# EAGLE design Mouse (EAGLE 7.5.0)
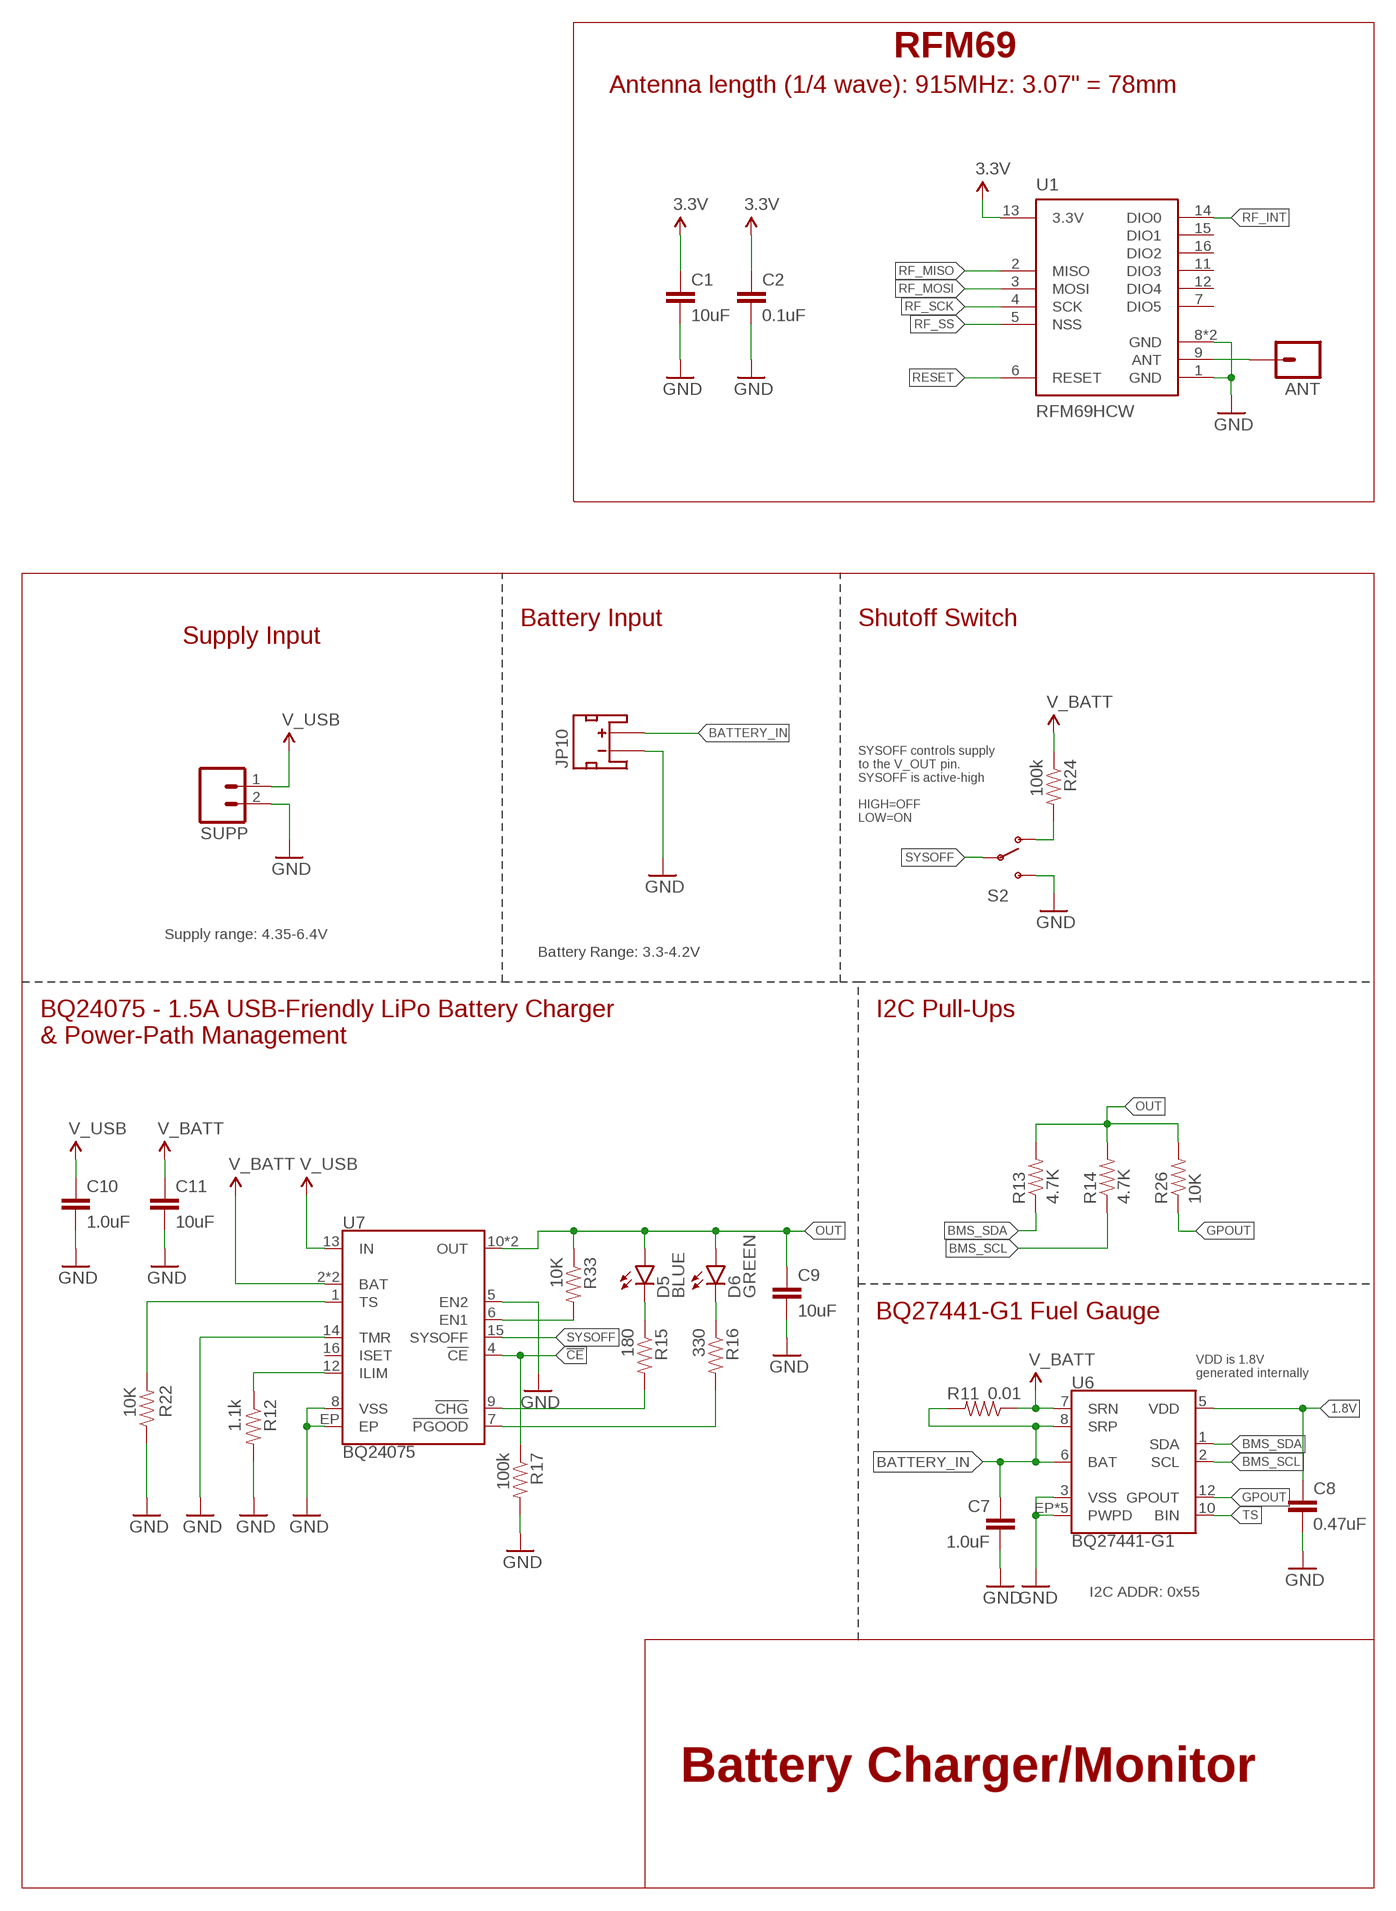
[diagram p0: schematic, sheet 1, part 1 of 2]
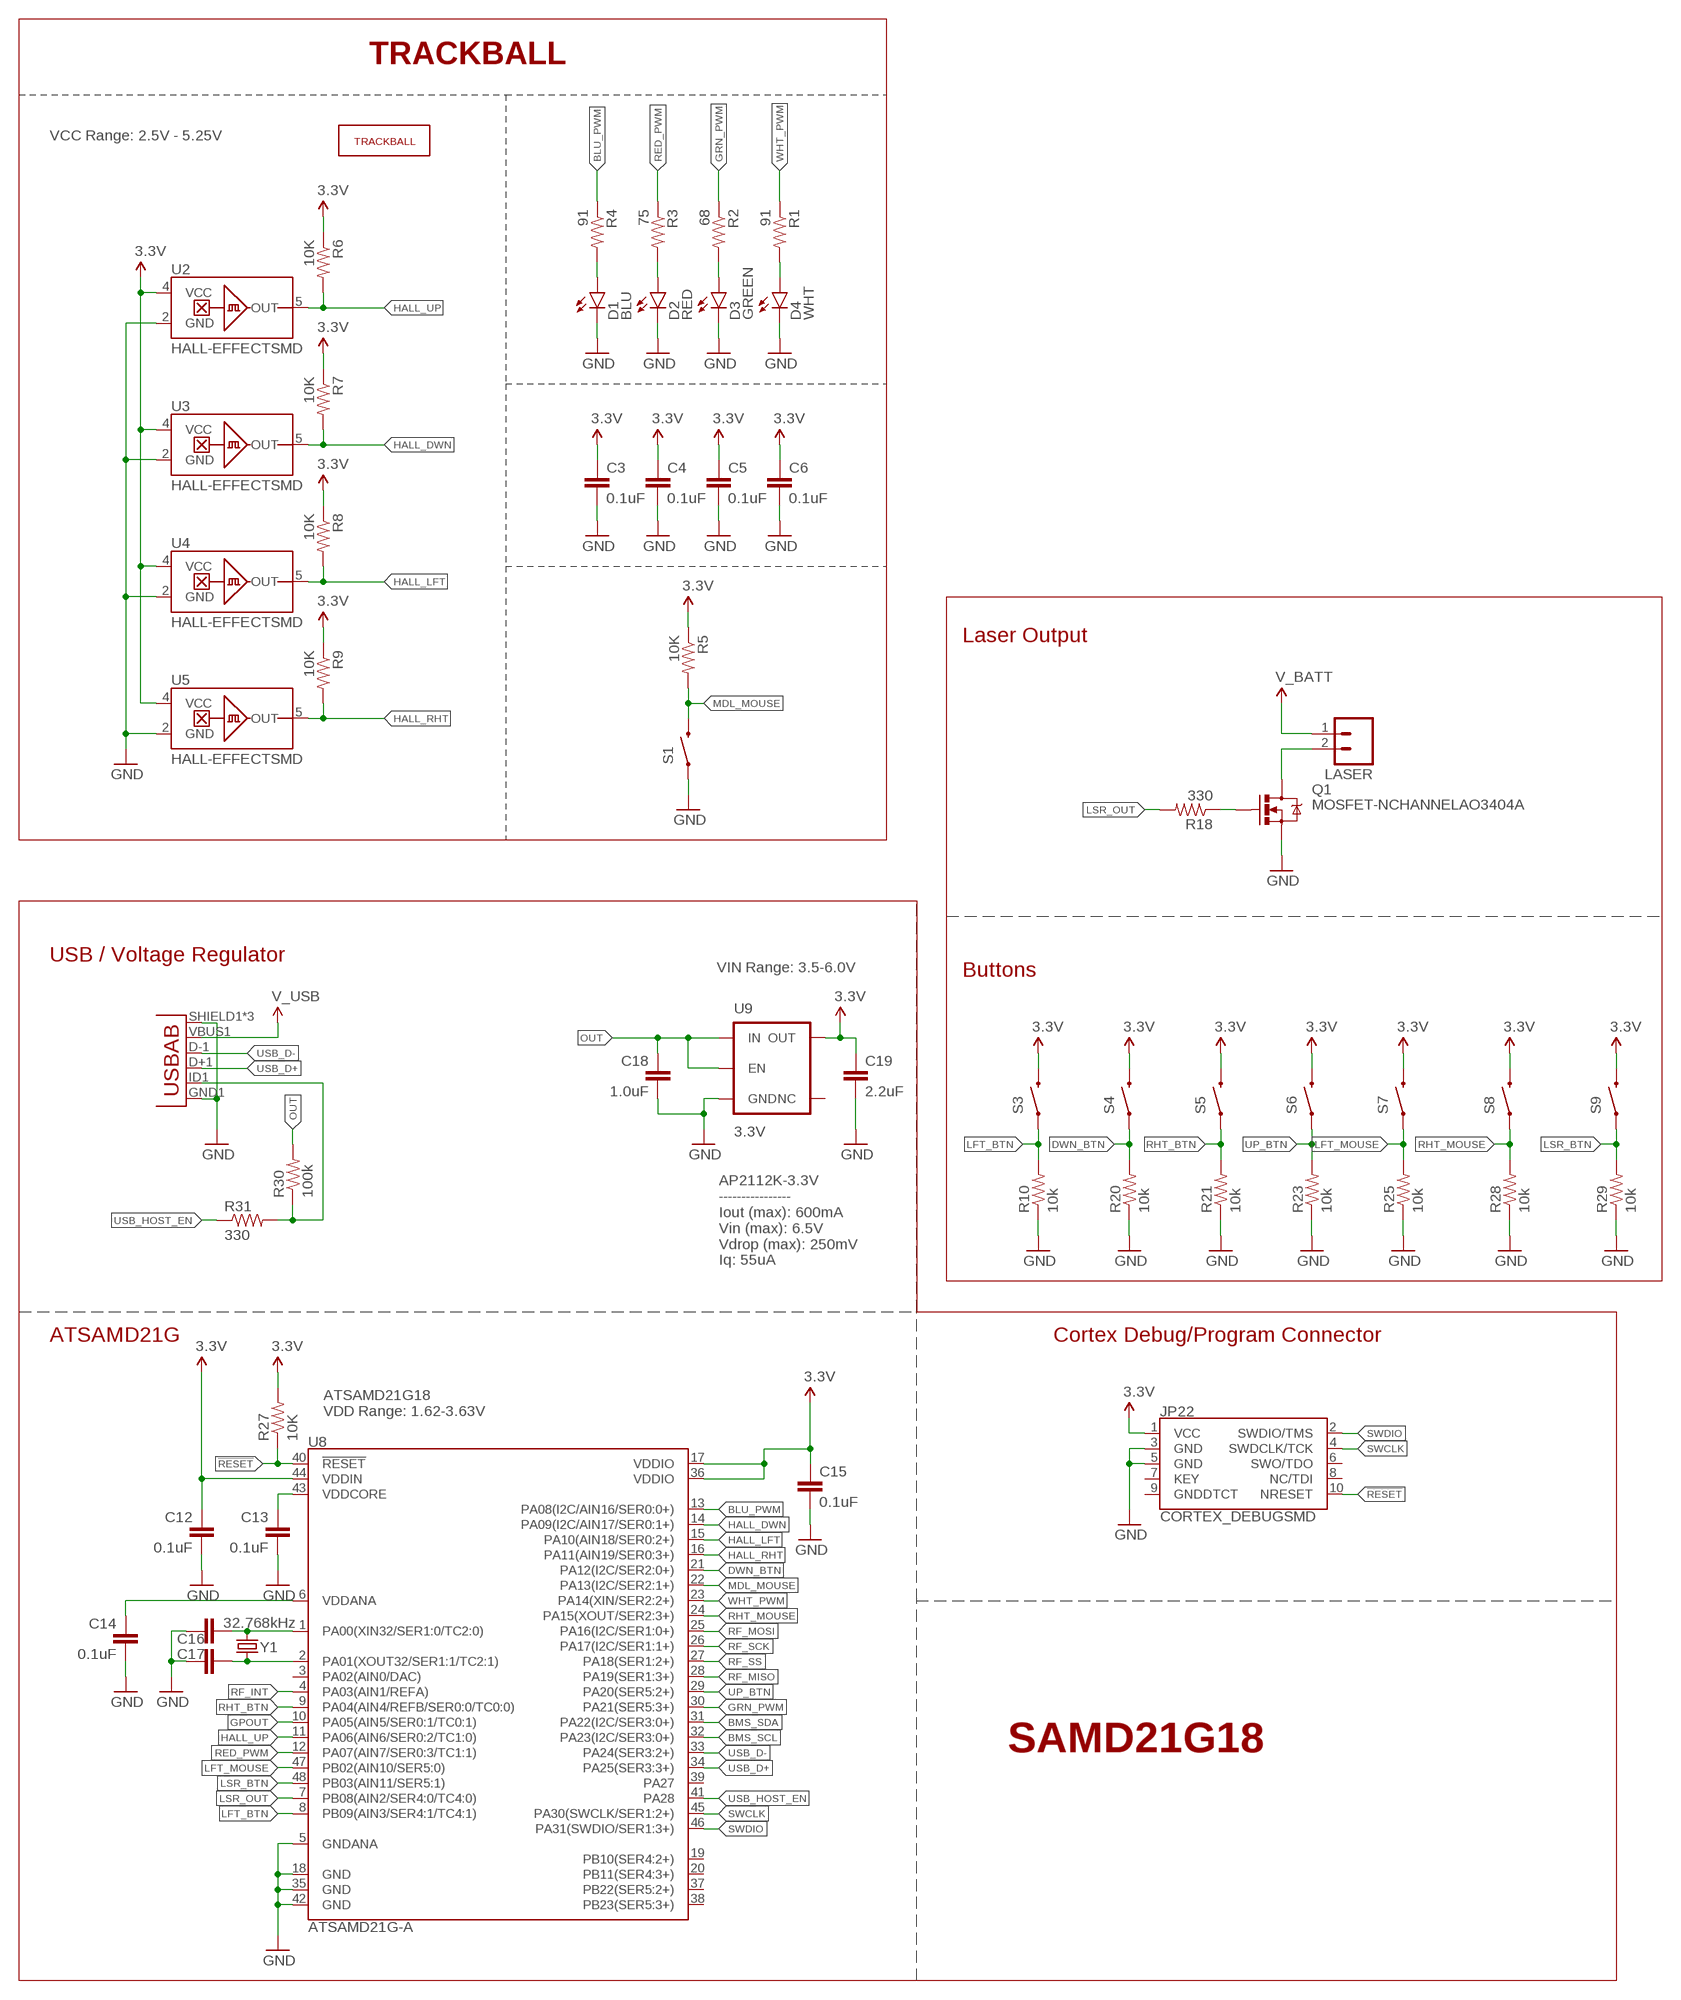
[diagram p1: schematic, sheet 1, part 2 of 2]

## Parts
ANT  M01PTH_NO_SILK_YES_STOP  [1X01_NO_SILK]
C1  10uF  10UF50V20%(1210)  [1210]
C2  0.1uF  0.1UF-25V(+80/-20%)(0603)  [0603-CAP]
C3  0.1uF  0.1UF-25V(+80/-20%)(0603)  [0603-CAP]
C4  0.1uF  0.1UF-25V(+80/-20%)(0603)  [0603-CAP]
C5  0.1uF  0.1UF-25V(+80/-20%)(0603)  [0603-CAP]
C6  0.1uF  0.1UF-25V(+80/-20%)(0603)  [0603-CAP]
C7  1.0uF  1.0UF-16V-10%(0603)  [0603-CAP]
C8  0.47uF  CAP0603-CAP  [0603-CAP]
C9  10uF  10UF10V10%(0805)  [0805-CAP]
C10  1.0uF  1.0UF50V10%(1206)  [1206-CAP]
C11  10uF  10UF10V10%(0805)  [0805-CAP]
C12  0.1uF  CAP0603-CAP  [0603-CAP]
C13  0.1uF  CAP0603-CAP  [0603-CAP]
C14  0.1uF  CAP0603-CAP  [0603-CAP]
C15  0.1uF  CAP0603-CAP  [0603-CAP]
C16  15pF  CAP0603-CAP  [0603-CAP]
C17  15pF  CAP0603-CAP  [0603-CAP]
C18  1.0uF  1.0UF-25V-+80/-20(0805)"  [0805-CAP]
C19  2.2uF  2.2UF-10V-20%(0603)  [0603-CAP]
D1  BLU  LED-BLUE0603  [LED-0603]
D2  RED  LED-RED0603  [LED-0603]
D3  GREEN  LED-GREEN0603  [LED-0603]
D4  WHT  LED-WHITE0603  [LED-0603]
D5  BLUE  LED-BLUE0603  [LED-0603]
D6  GREEN  LED-RED0603  [LED-0603]
JP10  JST_2MM_MALE  [JST-2-SMD]
JP22  CORTEX_DEBUGSMD  [SAMTECH_FTSH-105-01]
JP23  USB-ABCONN-11794  [USB-AB-MICRO-SMD_V03]
LASER  M021X02_NO_SILK  [1X02_NO_SILK]
Q1  MOSFET-NCHANNELAO3404A  [SOT23-3]
R1  91  180OHM1/10W1%(0603)  [0603-RES@2]
R2  68  180OHM1/10W1%(0603)  [0603-RES@2]
R3  75  180OHM1/10W1%(0603)  [0603-RES@2]
R4  91  180OHM1/10W1%(0603)  [0603-RES@2]
R5  10K  10KOHM1/10W1%(0603)0603  [0603-RES@1]
R6  10K  10KOHM1/10W1%(0603)0603  [0603-RES@1]
R7  10K  10KOHM1/10W1%(0603)0603  [0603-RES@1]
R8  10K  10KOHM1/10W1%(0603)0603  [0603-RES@1]
R9  10K  10KOHM1/10W1%(0603)0603  [0603-RES@1]
R10  10k  330OHM1/10W1%(0603)  [0603-RES]
R11  0.01  RESISTOR1206  [1206]
R12  1.1k  RESISTOR0603-RES  [0603-RES]
R13  4.7K  4.7KOHM-1/10W-1%(0603)  [0603-RES@2]
R14  4.7K  4.7KOHM-1/10W-1%(0603)  [0603-RES@2]
R15  180  180OHM1/10W1%(0603)  [0603-RES@2]
R16  330  1KOHM-1/10W-1%(0603)  [0603-RES@2]
R17  100k  100KOHM-1/10W-1%(0603)  [0603-RES]
R18  330  330OHM1/10W1%(0603)  [0603-RES]
R20  10k  330OHM1/10W1%(0603)  [0603-RES]
R21  10k  330OHM1/10W1%(0603)  [0603-RES]
R22  10K  10KOHM-1/10W-1%(0603)0603  [0603-RES]
R23  10k  330OHM1/10W1%(0603)  [0603-RES]
R24  100k  100KOHM-1/10W-1%(0603)  [0603-RES]
R25  10k  330OHM1/10W1%(0603)  [0603-RES]
R26  10K  10KOHM-1/10W-1%(0603)0603  [0603-RES]
R27  10K  10KOHM-1/10W-1%(0603)0603  [0603-RES]
R28  10k  330OHM1/10W1%(0603)  [0603-RES]
R29  10k  330OHM1/10W1%(0603)  [0603-RES]
R30  100k  100KOHM-1/10W-1%(0603)  [0603-RES]
R31  330  330OHM1/10W1%(0603)  [0603-RES]
R33  10K  10KOHM-1/10W-1%(0603)0603  [0603-RES]
S1  SWITCH-MOMENTARY-2SMD-2  [TACTILE_SWITCH_SMD-2]
S2  SWITCH-SPDT-SMD-A  [SWITCH-SPST-SMD-A]
S3  SWITCH-MOMENTARY-2SMD-4  [TACTILE_SWITCH_TALL]
S4  SWITCH-MOMENTARY-2SMD-4  [TACTILE_SWITCH_TALL]
S5  SWITCH-MOMENTARY-2SMD-4  [TACTILE_SWITCH_TALL]
S6  SWITCH-MOMENTARY-2SMD-4  [TACTILE_SWITCH_TALL]
S7  SWITCH-MOMENTARY-2SMD-4  [TACTILE_SWITCH_TALL]
S8  SWITCH-MOMENTARY-2SMD-4  [TACTILE_SWITCH_TALL]
S9  SWITCH-MOMENTARY-2SMD-4  [TACTILE_SWITCH_TALL]
SUPP  M021X02_NO_SILK  [1X02_NO_SILK]
U1  RFM69HCW  [RFM69HCW-XXXS2]
U2  HALL-EFFECTSMD  [SC70]
U3  HALL-EFFECTSMD  [SC70]
U4  HALL-EFFECTSMD  [SC70]
U5  HALL-EFFECTSMD  [SC70]
U6  BQ27441-G1  [PDSO-N12]
U7  BQ24075  [PVQFN-N16]
U8  ATSAMD21G-A  [TQFP-48]
U9  3.3V  V_REG_AP2112K-3.3V  [SOT23-5]
U$1  TRACKBALLMECH  [TRACKBALL]
Y1  32.768kHz  CRYSTAL3.2X1.5MM  [CRYSTAL-SMD-3.2X1.5MM]

## Nets
1.8V: C8.1 U6.5(VDD)
3.3V: C1.1 C2.1 C3.1 C4.1 C5.1 C6.1 C12.1 C15.1 C19.1 JP22.1(VCC) R5.1 R6.1 R7.1 R8.1 R9.1 R27.2 S3.B2 S4.B2 S5.B2 S6.B2 S7.B2 S8.B2 S9.B2 U1.13(3.3V) U2.4(VCC) U3.4(VCC) U4.4(VCC) U5.4(VCC) U8.17(VDDIO) U8.36(VDDIO) U8.44(VDDIN) U9.5(OUT)
!CE!: R17.1 U7.4(!CE!)
!CHG!: R15.2 U7.9(!CHG!)
!PGOOD!: R16.2 U7.7(!PGOOD!)
!RESET: JP22.10(NRESET) R27.1 U8.40(!RESET!)
ANT: ANT.1 U1.9(ANT)
BATTERY_IN: C7.1 JP10.2(+) R11.2 U6.6(BAT) U6.8(SRP)
BLU_PWM: R4.1 U8.13(PA08(I2C/AIN16/SER0:0+))
BMS_SCL: R14.1 U6.2(SCL) U8.32(PA23(I2C/SER3:0+))
BMS_SDA: R13.1 U6.1(SDA) U8.31(PA22(I2C/SER3:0+))
DWN_BTN: R20.2 S4.A2 U8.21(PA12(I2C/SER2:0+))
EN1: R33.2 U7.6(EN1)
GND: C1.2 C2.2 C3.2 C4.2 C5.2 C6.2 C7.2 C8.2 C9.2 C10.2 C11.2 C12.2 C13.2 C14.2 C15.2 C16.1 C17.2 C18.2 C19.2 D1.C D2.C D3.C D4.C JP10.1(-) JP22.3(GND) JP22.5(GND) JP23.GND1(GND) JP23.SHIELD1(SHIELD) JP23.SHIELD2(SHIELD) JP23.SHIELD3(SHIELD) Q1.2(S) R10.1 R12.2 R17.2 R20.1 R21.1 R22.1 R23.1 R25.1 R28.1 R29.1 S1.2 S2.3(S) SUPP.2 U1.1(GND) U1.8(GND) U1.10(GND) U2.2(GND) U3.2(GND) U4.2(GND) U5.2(GND) U6.3(VSS) U6.EP1(PWPD) U6.EP2(PWPD) U6.EP3(PWPD) U6.EP4(PWPD) U6.EP(PWPD) U7.5(EN2) U7.8(VSS) U7.14(TMR) U7.EP U8.5(GNDANA) U8.18(GND) U8.35(GND) U8.42(GND) U9.2(GND)
GPOUT: R26.1 U6.12(GPOUT) U8.10(PA05(AIN5/SER0:1/TC0:1))
GRN_PWM: R2.1 U8.30(PA21(SER5:3+))
HALL_DWN: R7.2 U3.5(OUT) U8.14(PA09(I2C/AIN17/SER0:1+))
HALL_LFT: R8.2 U4.5(OUT) U8.15(PA10(AIN18/SER0:2+))
HALL_RHT: R9.2 U5.5(OUT) U8.16(PA11(AIN19/SER0:3+))
HALL_UP: R6.2 U2.5(OUT) U8.11(PA06(AIN6/SER0:2/TC1:0))
ILIM: R12.1 U7.12(ILIM)
LFT_BTN: R10.2 S3.A2 U8.8(PB09(AIN3/SER4:1/TC4:1))
LFT_MOUSE: R25.2 S7.A2 U8.47(PB02(AIN10/SER5:0))
LSR_BTN: R29.2 S9.A2 U8.48(PB03(AIN11/SER5:1))
LSR_OUT: R18.2 U8.7(PB08(AIN2/SER4:0/TC4:0))
MDL_MOUSE: R5.2 S1.1 U8.22(PA13(I2C/SER2:1+))
N$1: D3.A R2.2
N$2: D2.A R3.2
N$3: D1.A R4.2
N$4: D4.A R1.2
N$5: R24.2 S2.1(O)
N$6: Q1.1(G) R18.1
N$8: LASER.2 Q1.3(D)
N$10: C16.2 U8.1(PA00(XIN32/SER1:0/TC2:0)) Y1.P$2
N$11: D5.C R15.1
N$12: D6.C R16.1
N$13: C17.1 U8.2(PA01(XOUT32/SER1:1/TC2:1)) Y1.P$1
N$19: JP23.ID1(USBID) R30.1 R31.2
OUT: C9.1 C18.1 D5.A D6.A R13.2 R14.2 R26.2 R30.2 R33.1 U7.10(OUT) U7.11(OUT) U9.1(IN) U9.3(EN)
RED_PWM: R3.1 U8.12(PA07(AIN7/SER0:3/TC1:1))
RESET: U1.6(RESET)
RF_INT: U1.14(DIO0) U8.4(PA03(AIN1/REFA))
RF_MISO: U1.2(MISO) U8.28(PA19(SER1:3+))
RF_MOSI: U1.3(MOSI) U8.25(PA16(I2C/SER1:0+))
RF_SCK: U1.4(SCK) U8.26(PA17(I2C/SER1:1+))
RF_SS: U1.5(NSS) U8.27(PA18(SER1:2+))
RHT_BTN: R21.2 S5.A2 U8.9(PA04(AIN4/REFB/SER0:0/TC0:0))
RHT_MOUSE: R28.2 S8.A2 U8.24(PA15(XOUT/SER2:3+))
SWCLK: JP22.4(SWDCLK/TCK) U8.45(PA30(SWCLK/SER1:2+))
SWDIO: JP22.2(SWDIO/TMS) U8.46(PA31(SWDIO/SER1:3+))
SYSOFF: S2.2(P) U7.15(SYSOFF)
TS: R22.2 U6.10(BIN) U7.1(TS)
UP_BTN: R23.2 S6.A2 U8.29(PA20(SER5:2+))
USB_D+: JP23.D+1(D+) U8.34(PA25(SER3:3+))
USB_D-: JP23.D-1(D-) U8.33(PA24(SER3:2+))
USB_HOST_EN: R31.1 U8.41(PA28)
V_BATT: C11.1 LASER.1 R11.1 R24.1 U6.7(SRN) U7.2(BAT) U7.3(BAT)
V_USB: C10.1 JP23.VBUS1(VBUS) SUPP.1 U7.13(IN)
VDDANA: C14.1 U8.6(VDDANA)
VDDCORE: C13.1 U8.43(VDDCORE)
WHT_PWM: R1.1 U8.23(PA14(XIN/SER2:2+))
Unconnected: JP10.NC1(PAD1) JP10.NC2(PAD2) JP22.6(SWO/TDO) JP22.7(KEY) JP22.8(NC/TDI) JP22.9(GNDDTCT) U1.7(DIO5) U1.11(DIO3) U1.12(DIO4) U1.15(DIO1) U1.16(DIO2) U7.16(ISET) U8.3(PA02(AIN0/DAC)) U8.19(PB10(SER4:2+)) U8.20(PB11(SER4:3+)) U8.37(PB22(SER5:2+)) U8.38(PB23(SER5:3+)) U8.39(PA27) U9.4(NC)

## Notes on the sheet
- TRACKBALL
- VCC Range: 2.5V - 5.25V
- RFM69
- Antenna length (1/4 wave): 915MHz: 3.07" = 78mm
- Laser Output
- Battery Input | Shutoff Switch
- Supply Input
- USB / Voltage Regulator
- VIN Range: 3.5-6.0V | Buttons
- SYSOFF controls supply 
  to the V_OUT pin.
  SYSOFF is active-high
  
  HIGH=OFF
  LOW=ON
- Supply range: 4.35-6.4V
- Battery Range: 3.3-4.2V
- AP2112K-3.3V
  ----------------
  Iout (max): 600mA 
  Vin (max): 6.5V
  Vdrop (max): 250mV
  Iq: 55uA
- BQ24075 - 1.5A USB-Friendly LiPo Battery Charger 
  & Power-Path Management
- I2C Pull-Ups
- ATSAMD21G | Cortex Debug/Program Connector
- ATSAMD21G18
  VDD Range: 1.62-3.63V
- BQ27441-G1 Fuel Gauge
- VDD is 1.8V
  generated internally
- I2C ADDR: 0x55
- SAMD21G18
- Battery Charger/Monitor

## Library data of the parts
ANT = SparkFun-Connectors:M01: Header 1 Standard 1-pin 0.1" header. Use with straight break away headers (SKU : PRT-00116), right angle break away headers (PRT-00553), swiss pins (PRT-00743), machine pins (PRT-00117), and female headers (PRT-00115). SMTSO-256-ET is a "flush mount" nut for a 4-40 screw. The older package used to be too tight, and did not allow it to sit properly thru the drill hit. The latest (0.165DIA) fits nice and snug.
C1 = SparkFun-Capacitors:10UF50V20%(1210): CAP-09824; PROD_ID: CAP-09824
C2-C6 = SparkFun-Capacitors:0.1UF-25V(+80/-20%)(0603): CAP-00810 Ceramic Standard decoupling cap; PROD_ID: CAP-00810
C7 = SparkFun-Capacitors:1.0UF-16V-10%(0603): CAP-00868; PROD_ID: CAP-00868
C8 = SparkFun-Capacitors:CAP: Capacitor Standard 0603 ceramic capacitor, and 0.1" leaded capacitor.; PROD_ID: CAP-13216
C9 C11 = SparkFun-Capacitors:10UF10V10%(0805): CAP-11330; PROD_ID: CAP-11330
C10 = SparkFun-Capacitors:1.0UF50V10%(1206): CAP-09822; PROD_ID: CAP-09822
C12-C17 = SparkFun-Capacitors:CAP: Capacitor Standard 0603 ceramic capacitor, and 0.1" leaded capacitor.
C18 = SparkFun-Capacitors:1.0UF-25V-+80/-20(0805): CAP-11625; PROD_ID: CAP-11625
C19 = SparkFun-Capacitors:2.2UF-10V-20%(0603): CAP-07888; PROD_ID: CAP-07888
D1 = SparkFun-LED:LED-BLUE: Blue LEDs for production use Various blue LEDs stocked by SparkFun production 0603 - DIO-08575 Rebel - DIO-09553 1206 - DIO-09911; PROD_ID: DIO-08575; VALUE: BLUE
D2 = SparkFun-LED:LED-RED: Assorted Red LEDs LilyPad 1206- DIO-09912 1206- DIO-00809 0603- DIO-00819 "SMART" means more efficient and expensive; PROD_ID: DIO-00819
D3 = SparkFun-LED:LED-GREEN: Various green LEDs Green LEDs used in SFE Production 0603- DIO-00821 LARGE- DIO-00862 LILYPAD- DIO-09910; PROD_ID: DIO-00821
D4 = SparkFun-LED:LED-WHITE: White SMD LEDs LilyPad 1206- DIO-09955; PROD_ID: DIO-09004
D5 = SparkFun-LED:LED-BLUE: Blue LEDs for production use Various blue LEDs stocked by SparkFun production 0603 - DIO-08575 Rebel - DIO-09553 1206 - DIO-09911; PROD_ID: DIO-08575
D6 = SparkFun-LED:LED-RED: Assorted Red LEDs LilyPad 1206- DIO-09912 1206- DIO-00809 0603- DIO-00819 "SMART" means more efficient and expensive; PROD_ID: DIO-00819; VALUE: RED
JP10 = SparkFun-Connectors:JST_2MM_MALE: Mates to single-cell LiPo batteries. CONN-11443 Now with smashable polarity marks!; BTM_NEG: -; BTM_POS: +; PROD_ID: CONN-11443; TOP_NEG: -; TOP_POS: +
JP22 = SparkFun-Connectors:CORTEX_DEBUG: Cortex Debug Connector Datasheet <http://infocenter.arm.com/help/topic/com.arm.doc.faqs/attached/13634/cortex_debug_connectors.pdf>
JP23 = SparkFun-Connectors:USB-AB: This is a USB AB connector that is compatible with USB OTG. i.e. this connector can serve as a host or device; PROD_ID: CONN-11794
LASER = SparkFun-Connectors:M02: Standard 2-pin 0.1" header. Use with - straight break away headers ( PRT-00116) - right angle break away headers (PRT-00553) - swiss pins (PRT-00743) - machine pins (PRT-00117) - female headers (PRT-00115) Molex polarized connector foot print use with: PRT-08233 with associated crimp pins and housings. 2.54_SCREWTERM for use with PRT-10571. 3.5mm Screw Terminal footprints for PRT-08084 5mm Screw Terminal footprints for use with PRT-08432
Q1 = SparkFun-DiscreteSemi:MOSFET-NCHANNEL: Common NMOSFET Parts MFG P/N Store ID Prod ID FDD8780 TRANS-09984 SI7820DN TRANS-11055 FDS6630A IC-08089 2N7002PW TRANS-11151 FQP30N06L COM-10213 TRANS-10060 BSS123LT1G TRANS-08345 BSS138 TRANS-00830 BS170 2N7000; PROD_ID: TRAN-12988
R1-R4 = SparkFun-Resistors:180OHM1/10W1%(0603): RES-08788; PROD_ID: RES-08788; VALUE: 180
R5-R9 = SparkFun-Resistors:10KOHM1/10W1%(0603): RES-00824; PROD_ID: RES-00824
R10 R20 R21 R23 R25 R28 R29 = SparkFun-Resistors:330OHM1/10W1%(0603): RES-00818; PROD_ID: RES-00818; VALUE: 330
R11 = SparkFun-Resistors:RESISTOR: Resistor Basic schematic elements and footprints for 0603, 1206, and PTH resistors.; PROD_ID: RES-13218
R12 = SparkFun-Passives:RESISTOR: Resistor Basic schematic elements and footprints for 0603, 1206, and PTH resistors.; PROD_ID: RES-10447
R13 R14 = SparkFun-Resistors:4.7KOHM-1/10W-1%(0603): RES-07857; PROD_ID: RES-07857
R15 = SparkFun-Resistors:180OHM1/10W1%(0603): RES-08788; PROD_ID: RES-08788
R16 = SparkFun-Resistors:1KOHM-1/10W-1%(0603): RES-07856; PROD_ID: RES-07856; VALUE: 1K
R17 R24 R30 = SparkFun-Resistors:100KOHM-1/10W-1%(0603): RES-07828; PROD_ID: RES-07828
R18 R31 = SparkFun-Resistors:330OHM1/10W1%(0603): RES-00818; PROD_ID: RES-00818
R22 R26 R27 R33 = SparkFun-Resistors:10KOHM-1/10W-1%(0603): RES-00824; PROD_ID: RES-00824
S1 = SparkFun-Electromechanical:SWITCH-MOMENTARY-2: Various NO switches- pushbuttons, reed, etc; PROD_ID: SWCH-09213
S2 = SparkFun-Electromechanical:SWITCH-SPDT: SPDT Switch Simple slide switch, Spark Fun Electronics SKU : COM-00102 DPDT SMT slide switch, AYZ0202, SWCH-08179; PROD_ID: SWCH-10651
S3-S9 = SparkFun-Electromechanical:SWITCH-MOMENTARY-2: Various NO switches- pushbuttons, reed, etc; PROD_ID: SWCH-11966
SUPP = mike-temp:M02: Header 2 Standard 2-pin 0.1" header. Use with straight break away headers (SKU : PRT-00116), right angle break away headers (PRT-00553), swiss pins (PRT-00743), machine pins (PRT-00117), and female headers (PRT-00115). Molex polarized connector foot print use with SKU : PRT-08233 with associated crimp pins and housings.
U1 = mike-temp:RFM69H
U2-U5 = SparkFun-Sensors:HALL-EFFECT: Hall effect sensor in SC70 package; PROD_ID: IC-09214
U6 = battery-management-temp:BQ27441-G1; PROD_ID: IC-13220
U7 = battery-management-temp:BQ24075; PROD_ID: IC-13219
U8 = samd21-temp:ATSAMD21G: Atmel SAMD21G SMART ARM-Based Microcontroller The Atmel ® | SMART ™ SAM D21 is a series of low-power microcontrollers using the 32-bit ARM ® Cortex ® -M0+ processor, and ranging from 32- to 64-pins with up to 256KB Flash and 32KB of SRAM. The SAM D21 devices operate at a maximum frequency of 48MHz and reach 2.46 CoreMark/MHz. They are designed for simple and intuitive migration with identical peripheral modules, hex compatible code, identical linear address map and pin compatible migration paths between all devices in the product series. All devices include intelligent and flexible peripherals, Atmel Event System for inter-peripheral signaling, and support for capacitive touch button, slider and wheel user interfaces.; PROD_ID: IC-13064
U9 = SparkFun-PowerIC:V_REG_AP2112: AP2112 - 600mA CMOS LDO Regulator w/ Enable The AP2112 is CMOS process low dropout linear regulator with enable function, the regulator delivers a guaranteed 600mA (min.) continuous load current. Features Output Voltage Accuracy: ±1.5% Output Current: 600mA (Min.) Foldback Short Current Protection: 50mA Enable Function to Turn ON/OFF VOUT Low Dropout Voltage (3.3V): 250mV (Typ.) @IOUT=600mA Excellent Load Regulation: 0.2%/A (Typ.) Excellent Line Regulation: 0.02%/V (Typ.) Low Quiescent Current: 55μA (Typ.) Low Standby Current: 0.01μA (Typ.) Low Output Noise: 50μVRMS PSRR: 100Hz -65dB, 1kHz -65dB OTSD Protection Stable with 1.0μF Flexible Cap: Ceramic, Tantalum and Aluminum Electrolytic Operation Temperature Range: -40°C to 85°C ESD: MM 400V, HBM 4000V; PROD_ID: VREG-12457
U$1 = SparkFun-Electromechanical:TRACKBALL: Mechanical footprint for trackball; PROD_ID: COMP-09237
Y1 = samd21-temp:CRYSTAL: Various standard crystals. Proven footprints.; PROD_ID: XTAL-13062

## Board
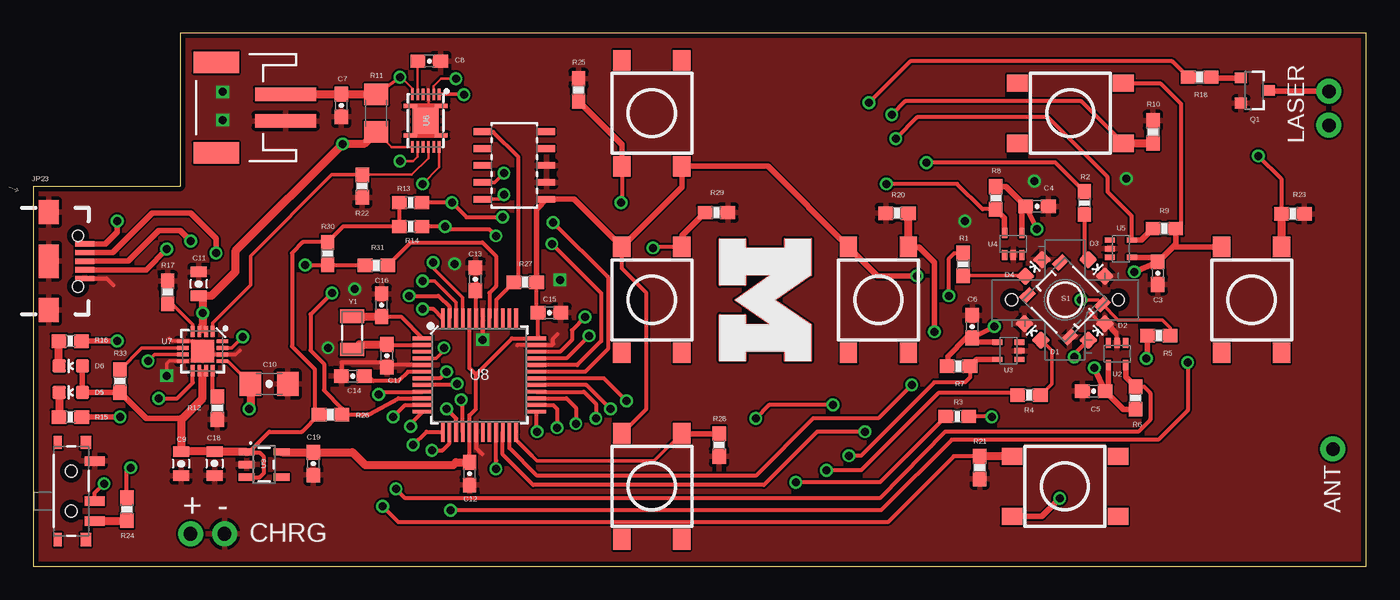
[diagram p2: board, top side]
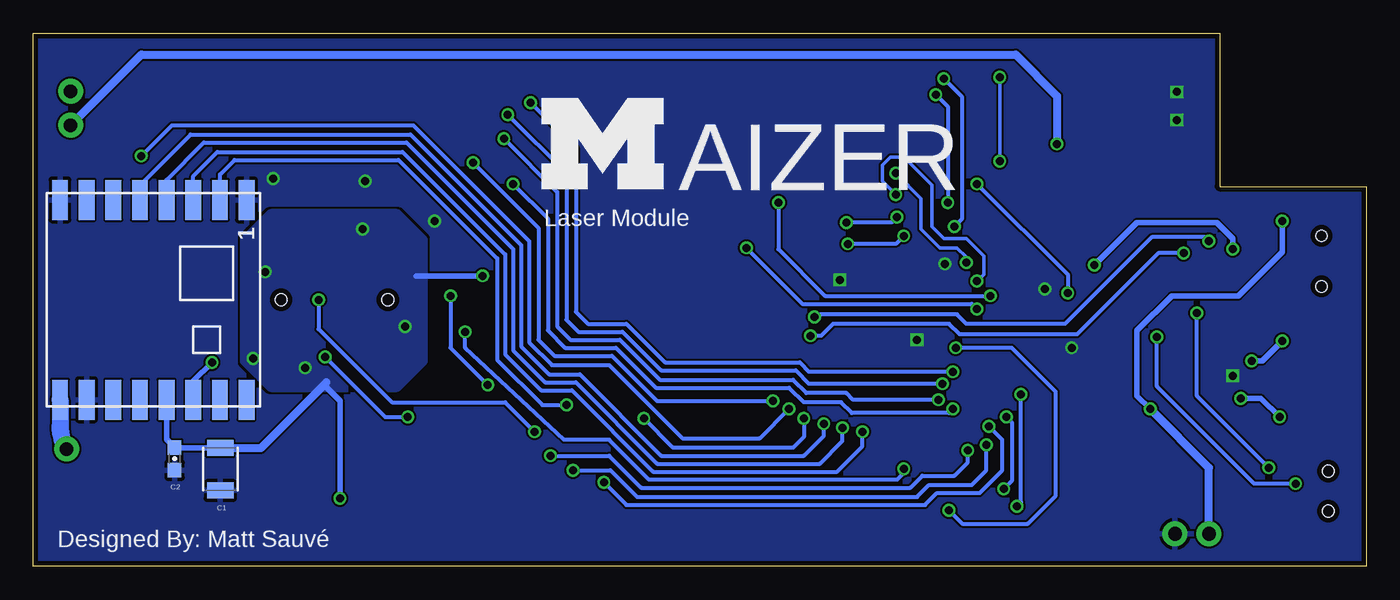
[diagram p3: board, bottom side, seen from below]

Size 100 x 40 mm. Coordinates in mm from the lower left corner, seen from the top.
Outline: 0,0 100,0 100,40 11,40 11,28.5 0,28.5 0,0
Copper layers (1*16): Top 0.0356mm / dielectric 1.5011mm / Bottom 0.0356mm
Design rules "oshpark-2layer": minimum track width 6mil, minimum drill 13mil, track to track 6mil, track to pad 6mil, pad to pad 6mil, via to via 6mil, smd to smd 6mil, copper to edge 15mil, drill to drill 6mil, minimum pad ring 7mil, minimum via ring 7mil, stop-mask expansion 2.5mil, vias tented up to drill 0mil, thermal gap 10mil

### Footprints (pad centres in the part's own frame; a part is rotated, then mirrored left to right if it is on the bottom)
1X01_NO_SILK = drill 1.016 pad 1.88: 1 0,0
1210 = smd 1.2 x 2: 1 -1.6,0; 2 1.6,0
0603-CAP = smd 1.1 x 1: 1 -0.85,0; 2 0.85,0
0805-CAP = smd 0.8 x 1.2: 1 -0.9,0; 2 0.9,0
1206-CAP = smd 1.6 x 1.8: 1 -1.4,0; 2 1.4,0
LED-0603 = smd 1 x 1: A 0,-0.877; C 0,0.877
JST-2-SMD = smd 1 x 4.6: 1 -1,-3.7; 2 1,-3.7 | smd 1.6 x 3.4: NC1 -3.4,1.5; NC2 3.4,1.5
SAMTECH_FTSH-105-01 = smd 0.508 x 1.27: 1 -2.54,-2.413; 2 -2.54,2.413; 3 -1.27,-2.413; 4 -1.27,2.413; 5 0,-2.413; 6 0,2.413; 7 1.27,-2.413; 8 1.27,2.413; 9 2.54,-2.413; 10 2.54,2.413
USB-AB-MICRO-SMD_V03 = smd 1.4 x 0.4: D+1 2.7,0; D-1 2.7,0.65; GND1 2.7,-1.3; ID1 2.7,-0.65; VBUS1 2.7,1.3 | smd 1.5 x 1.8: SHIELD1 0,3.68; SHIELD3 0,-3.68 | smd 1.5 x 2.5: SHIELD2 0,0 | hole 0.85: 2.2,1.9; 2.2,-1.9
1X02_NO_SILK = drill 1.016 pad 1.88: 1 0,0; 2 2.54,0
SOT23-3 = smd 0.8 x 0.9: 1 -0.95,-1; 2 0.95,-1; 3 0,1.1
0603-RES@2 = smd 1.1 x 1: 1 -0.85,0; 2 0.85,0
0603-RES@1 = smd 1.1 x 1: 1 -0.85,0; 2 0.85,0
0603-RES = smd 1.1 x 1: 1 -0.85,0; 2 0.85,0
1206 = smd 1.6 x 1.8: 1 -1.4,0; 2 1.4,0
TACTILE_SWITCH_SMD-2 = smd 0.7 x 1.1: 1 2.225,1.75; 2 2.225,-1.75; 3 -2.225,-1.75; 4 -2.225,1.75
SWITCH-SPST-SMD-A = smd 0.7 x 1.5: 1 -2.25,-1.75; 2 -0.75,-1.75; 3 2.25,-1.75 | smd 1 x 0.6: GND1 -3.65,1; GND3 3.65,1 | smd 1 x 0.8: GND2 -3.65,-1.1; GND4 3.65,-1.1 | hole 0.9: -1.5,0; 1.5,0
TACTILE_SWITCH_TALL = smd 1.55 x 1.3: A1 -3.975,-2.25; A2 3.975,-2.25; B1 -3.975,2.25; B2 3.975,2.25
RFM69HCW-XXXS2 = smd 3 x 1.2: 1 -7.5,7; 2 -7.5,5; 3 -7.5,3; 4 -7.5,1; 5 -7.5,-1; 6 -7.5,-3; 7 -7.5,-5; 8 -7.5,-7; 9 7.5,-7; 10 7.5,-5; 11 7.5,-3; 12 7.5,-1; 13 7.5,1; 14 7.5,3; 15 7.5,5; 16 7.5,7
SC70 = smd 0.4 x 0.75: 1 -0.65,-0.825; 2 0,-0.825; 3 0.65,-0.825; 4 0.65,0.825; 5 -0.65,0.825
PDSO-N12 = smd 0.2 x 0.85: 1 -1,-1.975; 2 -0.6,-1.975; 3 -0.2,-1.975; 4 0.2,-1.975; 5 0.6,-1.975; 6 1,-1.975; 7 1,1.975; 8 0.6,1.975; 9 0.2,1.975; 10 -0.2,1.975; 11 -0.6,1.975; 12 -1,1.975 | smd 1.95 x 1.95: EP 0,0 | smd 1 x 0.25: EP1 -1.15,1.1; EP2 -1.15,-1.1; EP3 1.15,-1.1; EP4 1.15,1.1
PVQFN-N16 = smd 0.28 x 0.85: 1 -0.75,-1.475; 2 -0.25,-1.475; 3 0.25,-1.475; 4 0.75,-1.475; 9 0.75,1.475; 10 0.25,1.475; 11 -0.25,1.475; 12 -0.75,1.475 | smd 0.85 x 0.28: 5 1.475,-0.75; 6 1.475,-0.25; 7 1.475,0.25; 8 1.475,0.75; 13 -1.475,0.75; 14 -1.475,0.25; 15 -1.475,-0.25; 16 -1.475,-0.75 | smd 1.7 x 1.7: EP 0,0
TQFP-48 = smd 1.5 x 0.28: 1 -4.25,2.75; 2 -4.25,2.25; 3 -4.25,1.75; 4 -4.25,1.25; 5 -4.25,0.75; 6 -4.25,0.25; 7 -4.25,-0.25; 8 -4.25,-0.75; 9 -4.25,-1.25; 10 -4.25,-1.75; 11 -4.25,-2.25; 12 -4.25,-2.75; 25 4.25,-2.75; 26 4.25,-2.25; 27 4.25,-1.75; 28 4.25,-1.25; 29 4.25,-0.75; 30 4.25,-0.25; 31 4.25,0.25; 32 4.25,0.75; 33 4.25,1.25; 34 4.25,1.75; 35 4.25,2.25; 36 4.25,2.75 | smd 0.28 x 1.5: 13 -2.75,-4.25; 14 -2.25,-4.25; 15 -1.75,-4.25; 16 -1.25,-4.25; 17 -0.75,-4.25; 18 -0.25,-4.25; 19 0.25,-4.25; 20 0.75,-4.25; 21 1.25,-4.25; 22 1.75,-4.25; 23 2.25,-4.25; 24 2.75,-4.25; 37 2.75,4.25; 38 2.25,4.25; 39 1.75,4.25; 40 1.25,4.25; 41 0.75,4.25; 42 0.25,4.25; 43 -0.25,4.25; 44 -0.75,4.25; 45 -1.25,4.25; 46 -1.75,4.25; 47 -2.25,4.25; 48 -2.75,4.25
SOT23-5 = smd 0.55 x 1.2: 1 -0.95,-1.3; 2 0,-1.3; 3 0.95,-1.3; 4 0.95,1.3; 5 -0.95,1.3
TRACKBALL = hole 0.9: -4,0; 4,0
CRYSTAL-SMD-3.2X1.5MM = smd 1 x 1.8: P$1 -1.25,0; P$2 1.25,0

### Placement (x,y rotation side)
ANT  97.5,8.8 180 top
C1  85.97,7.28 270 bottom
C2  89.4,8.06 270 bottom
C3  84.36,21.99 270 top
C4  75.3,27.01 0 top
C5  79.56,13.14 180 top
C6  70.44,17.98 90 top
C7  23.11,34.58 270 top
C8  29.71,37.91 0 top
C9  11.09,7.69 270 top
C10  17.69,13.68 0 top
C11  12.41,21.2 90 top
C12  32.73,6.95 270 top
C13  33.17,21.54 90 top
C14  23.97,14.27 180 top
C15  38.72,19.03 0 top
C16  26.13,19.59 270 top
C17  26.53,15.8 270 top
C18  13.59,7.71 270 top
C19  21.01,7.7 270 top
D1  74.98,17.59 45 top
D2  79.77,17.59 315 top
D3  79.76,22.39 225 top
D4  75.05,22.39 315 top
D5  2.81,13.04 90 top
D6  2.81,15.03 90 top
JP10  15.23,34.42 90 top
JP22  36.09,30.08 90 top
JP23  1.15,22.9 0 top
LASER  97.2,33.1 90 top
Q1  91.6,35.7 270 top
R1  69.75,22.66 270 top
R2  78.85,27.27 270 top
R3  69.32,11.25 0 top
R4  74.71,12.85 0 top
R5  84.44,17.31 0 top
R6  82.69,12.63 90 top
R7  69.42,15.01 0 top
R8  72.21,27.64 270 top
R9  84.85,25.34 180 top
R10  84,32.6 270 top
R11  25.72,34.01 90 top
R12  13.81,11.87 270 top
R13  28.3,27.3 180 top
R14  28.31,25.5 180 top
R15  2.78,11.2 0 top
R16  2.77,16.9 0 top
R17  10.08,20.56 90 top
R18  87.5,36.7 180 top
R20  64.8,26.5 0 top
R21  71,7.4 90 top
R22  24.68,28.53 90 top
R23  94.5,26.45 180 top
R24  7.02,4.28 270 top
R25  40.9,35.75 270 top
R26  22.29,11.38 180 top
R27  36.9,21.32 0 top
R28  51.45,9.1 90 top
R29  51.25,26.55 180 top
R30  22.08,23.47 90 top
R31  25.74,22.58 180 top
R33  6.5,13.9 90 top
S1  77.4,20 315 top
S2  2.84,5.64 90 top
S3  77.8,34 0 top
S4  63.4,20 90 top
S5  77.4,6 180 top
S6  91.4,20 90 top
S7  46.4,34 270 top
S8  46.4,6 90 top
S9  46.4,20 90 top
SUPP  11.8,2.43 0 top
U1  91,20 270 bottom
U2  81.31,15.94 180 top
U3  73.16,16.17 90 top
U4  73.52,24.19 0 top
U5  81.59,23.83 270 top
U6  29.44,33.44 180 top
U7  12.71,16.14 180 top
U8  33.47,14.35 0 top
U9  17.32,7.63 270 top
U$1  77.4,20 0 top
U$2  [BLOCK-M-10MM]  57.3,31.6 0 bottom
U$3  [BLOCK-M-10MM-MASK]  54.8,20 270 top
Y1  23.9,17.52 90 top

### Tracks (layer width: path | path; a pad name or v marks a point on that pad's centre or on a via)
1.8V
  Top 0.205: U6.5 28.84,37.89 C8.1
3.3V  (via drill 0.6)
  Top 0.305: C12.1 32.72,7.58 U8.17 32.72,11.32 33.2,11.8 33.2,14.4 | R27.2 37.75,19.52 C15.1 37.87,17.25 U8.36 35.9,17.1 33.2,14.4 | S8.B2 46,11.82 46,20.5 44.15,22.35 S9.B2 | S3.B2 84.55,36.25 86.1,34.7 86.1,25.74 R9.1 | 33.2,14.4 32.72,14.88 U8.44
  Top 0.406: U4.4 74.17,26.73 C4.1 | C4.1 72.97,28.49 R8.1 | C6.1 69.98,17.13 68.6,15.75 68.6,15.04 R7.1 | U3.4 70.75,16.82 C6.1 | U2.4 80.66,13.39 C5.1 | C5.1 81.77,11.78 R6.1 | U5.4 84.02,23.18 C3.1 | R9.1 85.7,24.18 85.5,23.98 | 85.5,23.98 C3.1 | v72.1,18 C6.1 | v75.3,25.3 C4.1 | v82.6,22.1 C3.1 | v79.6,14.9 C5.1 | R5.1 83.59,15.69 v83.5,15.6 | S6.B2 85.5,23.98 | S5.B2 75.65,3.75 v77,5.1 | v66.3,21.8 63.33,21.8 S4.B2 55.1,30.02 S7.B2 48.65,28.48 S9.B2 40.59,27.54 JP22.1 37.75,26.79 R27.2
  Top 0.61: U9.5 18.65,8.55 C19.1 23.95,8.55 24.9,7.6 31.5,7.6 31.7,7.8 C12.1
  Bottom 0.406: C1.1 89.37,8.88 C2.1 90,9.51 U1.13 | v77,5.1 77,12.4 78.2,13.6 | v66.3,21.8 71.3,21.8
  Bottom 0.61: C1.1 82.92,8.88 78.2,13.6 78,13.8
  pour Bottom: 82.2,13.4 72.7,13.4 70.7,15.4 70.7,24.5 72.7,26.5 82.2,26.5 84.2,24.5 84.2,15.4
!CE!
  Top 0.254: U7.4 11.96,18.14 10.39,19.71 R17.1
!CHG!  (via drill 0.6)
  Top 0.305: v9.4,12.6 10.8,12.6 11.96,13.76 U7.9
  Top 0.406: R15.2 v6.5,11.2
  Bottom 0.406: v6.5,11.2 7.9,12.6 v9.4,12.6
!PGOOD!  (via drill 0.6)
  Top 0.254: v8.6,15.4 9.09,15.89 U7.7
  Top 0.406: R16.2 v6.3,16.9
  Bottom 0.406: v6.3,16.9 7.8,15.4 v8.6,15.4
!RESET
  Top 0.305: U8.40 34.72,19.99 R27.1 36.4,21.67 36.4,30.7 34.5,32.6 33.7,32.6 JP22.10
ANT
  Bottom 1.27: U1.9 98,10.5 arc-33 ANT.1
BATTERY_IN  (via drill 0.6)
  Top 0.205: U6.8 28.84,30.74 28.5,30.4 v27.5,30.4 | v27.5,36.7 27.6,36.7 28.44,35.86 U6.6
  Top 0.254: v27.5,36.7 R11.2
  Top 0.61: JP10.2 C7.1 25.72,35.43 R11.2
  Bottom 0.254: v27.5,30.4 v27.5,36.7
BLU_PWM  (via drill 0.6)
  Top 0.305: R4.1 73.9,12.89 73.9,13 67.9,13 62.1,7.2 v59.5,7.2 | v28.5,9.1 29.5,10.1 U8.13
  Bottom 0.305: v59.5,7.2 56.7,7.2 54.7,5.2 33.7,5.2 32.8,6.1 29.6,6.1 28.5,7.2 v28.5,9.1
BMS_SCL  (via drill 0.6)
  Top 0.205: U6.2 30.04,36.04 30.6,36.6 v31.7,36.6
  Top 0.305: R14.1 v30.9,25.5 31.1,25.3 34.2,25.3 v34.7,24.8 | v38.9,24.2 42.6,20.5 42.6,16.9 40.8,15.1 U8.32
  Bottom 0.305: v30.9,25.5 30.3,26.1 30.3,35.2 v31.7,36.6 | v34.7,24.8 35.3,24.2 v38.9,24.2
BMS_SDA  (via drill 0.6)
  Top 0.254: U6.1 32.28,35.41 v32.3,35.4
  Top 0.305: R13.1 v31.4,27.3 32.5,26.2 v35.2,26.2 | v39,25.8 43.1,21.7 43.1,16.3 41.4,14.6 U8.31
  Bottom 0.305: v32.3,35.4 31.4,34.5 v31.4,27.3 | v35.2,26.2 35.6,25.8 v39,25.8
DWN_BTN  (via drill 0.6)
  Top 0.305: v34.7,7.3 34.72,7.92 U8.21
  Top 0.406: S4.A2 66.42,23.98 67.6,22.8 v67.6,17.6
  Top 0.61: S4.A2 R20.2
  Bottom 0.305: v67.6,17.6 67.6,16.4 60.2,9.5 56.8,9.5 53.8,6.5 35.2,6.5 34.7,7 v34.7,7.3
EN1
  Top 0.254: R33.2 8.14,16.39 U7.6
GND  (via drill 0.6)
  Top 0.205: U6.3 29.64,34.54
  Top 0.254: 29.64,34.54 U6.EP2 29.4,34.54 29.4,33.4 | U6.EP4 29.44,32.34 | U6.EP1 29.44,32.34 | 29.44,32.34 U6.EP 29.44,34.54 U6.EP3 | 15.5,16.2 15.19,15.89 U7.14 12.96,15.89 U7.EP 11.96,16.89 U7.5 10.41,16.89 10.2,17.1 | U7.8 10.19,15.39 10,15.2 v10,14.3 | D2.C 81.31,17.29 U2.2 | D2.C 80.69,18.21 81.3,17.6 81.3,17.1 | D2.C 80.09,18.21 79.3,19
  Top 0.305: U8.42 33.72,17.18 33.8,17.1 | JP23.GND1 5.5,21.6 6,21.1 | 39.3,17.4 39,17.1 39,16.7 38.9,16.6 U8.35 36.3,16.6 | U8.18 33.22,8.88 33.7,8.4 | U8.5 26.68,15.1 C17.2 26.18,15.3 23.12,15.3 C14.2
  other vias: 14.2,33.5 14.2,35.6 33.7,17 31.6,22.7 22.1,16.4 82,29.1 39.5,21.5 75.1,28.9 69.9,25.9 24.1,20.8
  pour Top: 0,28.5 11,28.5 11,40 100,40 100,0 0,0
  pour Bottom (rank 4): 0,28.5 11,28.5 11,40 100,40 100,0 0,0
GPOUT  (via drill 0.6)
  Top 0.205: v29.2,28.7 30.44,29.94 U6.12
  Top 0.305: U8.10 27.4,12.6 25.2,11.4 23.16,11.4 R26.1 23.14,11.86 21.8,13.2 21.8,15.2 20.8,16.2 20.8,18.9 v22.4,20.5
  Bottom 0.305: v29.2,28.7 22.4,21.9 v22.4,20.5
GRN_PWM  (via drill 0.6)
  Top 0.305: R2.1 76.67,30.3 v67,30.3 | v44.5,12.4 42.8,14.1 U8.30
  Bottom 0.305: v67,30.3 62.1,25.4 62.1,17 60.9,15.8 56.6,15.8 53.2,12.4 v44.5,12.4
HALL_DWN  (via drill 0.6)
  Top 0.305: R7.2 70.27,14.17 69.9,13.8 67.6,13.8 62.1,8.3 v61.2,8.3 | v29.9,8.7 30.7,8.7 31.22,9.22 U8.14
  Top 0.406: R7.2 70.78,15.52 U3.5
  Bottom 0.305: v61.2,8.3 56.8,8.3 54.4,5.9 34.2,5.9 33.3,6.8 30.9,6.8 29.9,7.8 v29.9,8.7
HALL_LFT  (via drill 0.6)
  Top 0.305: R8.2 71.21,26.79 69.3,28.7 v64,28.7 | U8.15 31.72,11.08 v31,11.8
  Top 0.406: U4.5 72.87,26.13 R8.2
  Bottom 0.305: v64,28.7 61.4,26.1 61.4,17.7 60.1,16.4 56.3,16.4 53.3,13.4 43.3,13.4 42.2,12.3 39.4,12.3 38.6,11.5 31.3,11.5 v31,11.8
HALL_RHT  (via drill 0.6)
  Top 0.305: U5.5 82.42,26.29 80.6,28.1 80.6,29.2 76.1,33.7 66.3,33.7 v64.7,32.1 | U8.16 32.22,12.38 v32.1,12.5
  Top 0.406: R9.2 83.14,24.48 U5.5
  Bottom 0.305: v64.7,32.1 60.7,28.1 60.7,18 59.7,17 56,17 53,14 43,14 42,13 39,13 38.5,12.5 v32.1,12.5
HALL_UP  (via drill 0.6)
  Top 0.305: R6.2 83.32,13.48 83.8,13 83.8,11 82.9,10.1 68.4,10.1 63.5,5.1 27.9,5.1 v27.2,5.8 | v27,11.2 27.9,12.1 U8.11
  Top 0.406: R6.2 81.96,14.21 U2.5
  Bottom 0.305: 27,6 v27.2,5.8 26.6,6.4 26.6,10.8 v27,11.2
ILIM
  Top 0.305: R12.1 13.46,13.07 U7.12
LFT_BTN  (via drill 0.6)
  Top 0.305: S3.A2 78.62,34.9 65.4,34.9 v64.4,33.9 | v31.8,13.7 31.7,13.6 U8.8
  Top 0.61: S3.A2 R10.2
  Bottom 0.305: v64.4,33.9 60,29.5 60,18.5 59.1,17.6 55.8,17.6 52.9,14.7 42.8,14.7 41.8,13.7 v31.8,13.7
LFT_MOUSE  (via drill 0.6)
  Top 0.305: S7.A2 44.15,27.35 v44.1,27.3 | v28.2,20.3 30.4,20.3 31.22,19.48 U8.47
  Top 0.406: R25.2 44.15,31.65 S7.A2
  Bottom 0.305: v44.1,27.3 44.1,23.8 40.6,20.3 v28.2,20.3
LSR_BTN  (via drill 0.6)
  Top 0.305: S9.A2 46.58,23.98 v46.5,23.9 | U8.48 30.02,19.3 v29.2,19.3
  Top 0.406: S9.A2 48.67,24 48.67,24.82 R29.2
  Bottom 0.305: v46.5,23.9 42.3,19.7 29.6,19.7 v29.2,19.3
LSR_OUT  (via drill 0.6)
  Top 0.305: R18.2 85.45,37.9 65.8,37.9 v62.7,34.8 | v31,14.6 30.5,14.1 U8.7
  Bottom 0.305: v62.7,34.8 59.3,31.4 59.3,19.1 58.4,18.2 55.5,18.2 52.6,15.3 42.5,15.3 41.8,14.6 v31,14.6
MDL_MOUSE  (via drill 0.6)
  Top 0.254: R5.2 85.3,17.9 84.7,18.5 81.38,18.5 S1.1 79.88,20 v78.6,20
  Top 0.305: v62.4,10.1 58.8,10.1 54.8,6.1 37.5,6.1 35.22,8.38 U8.22
  Bottom 0.305: v78.6,20 78.6,17.8 73.1,12.3 64.6,12.3 v62.4,10.1
N$1
  Top 0.305: R2.2 78.85,23.3 D3.A
N$2  (via drill 0.6)
  Top 0.305: D2.A 78.1,15.92 v78.1,15.7 | v71.9,11.2 71.85,11.25 R3.2
  Bottom 0.305: v78.1,15.7 73.6,11.2 v71.9,11.2
N$3
  Top 0.254: R4.2 76.4,13.69 76.4,16.2 75.63,16.97 D1.A
N$4
  Top 0.254: D4.A 74.39,21.81 R1.2
N$5
  Top 0.61: S2.1 7.02,3.39 R24.2
N$6
  Top 0.406: R18.1 88.4,36.65 Q1.1
N$8
  Top 0.406: Q1.3 92.76,35.64 LASER.2
N$10
  Top 0.305: C16.2 27.58,18.74 U8.1
  Top 0.61: Y1.P$2 24.07,18.74 C16.2
N$11
  Top 0.61: D5.C R15.1
N$12
  Top 0.61: D6.C R16.1
N$13
  Top 0.305: C17.1 26.75,16.6 U8.2
  Top 0.61: Y1.P$1 23.91,16.08 24.48,16.65 C17.1
N$19  (via drill 0.6)
  Top 0.305: v20.4,22.6 22.06,22.6 R30.1 24.85,22.62 R31.2
  Top 0.406: JP23.ID1 8.45,22.25 v10,23.8
  Bottom 0.406: v10,23.8 10,24.6 11.2,25.8 17.2,25.8 v20.4,22.6
OUT
  Top 0.254: 12.7,14.2 12.7,14.66 U7.10 U7.11
  Top 0.305: R13.2 R14.2 23.26,25.5 R30.2 20.22,24.32 19.4,23.5 19.4,16.5 21.1,14.8 21.1,11.62 R26.2 20.16,10.1 17.7,10.1 16.18,8.58 U9.1 16.1,8.5 17,8.5 17.3,8.2 17.3,7 16.98,6.68 U9.3
  Top 0.406: D6.A D5.A | D5.A R33.1 8.45,11.1 11.2,11.1
  Top 0.61: U9.1 13.62,8.58 C18.1 11.11,8.61 C9.1 11.09,10.99 11.2,11.1 12.7,12.6 12.7,14.2 | D5.A
RED_PWM  (via drill 0.6)
  Top 0.305: R3.1 63.52,6.3 v57.2,6.3 | v28.3,10.5 28.3,10.68 U8.12
  Bottom 0.305: v57.2,6.3 55.5,4.6 33.1,4.6 32.2,5.5 29,5.5 27.3,7.2 27.3,9.5 v28.3,10.5
RF_INT  (via drill 0.6)
  Top 0.254: U8.4 30.2,15.6 30.8,16.2 v30.8,16.4
  Top 0.305: v86.6,15.3 86.6,11.7 84.4,9.5 68.9,9.5 63.6,4.2 v31.3,4.2
  Bottom 0.305: v31.3,4.2 30.3,3.2 25.4,3.2 23.3,5.3 23.3,13.1 26.6,16.4 v30.8,16.4
  Bottom 0.406: U1.14 88,13.9 v86.6,15.3
RF_MISO  (via drill 0.6)
  Top 0.305: v60,12.1 55.2,12.1 v54.2,11.1 | U8.28 41.3,13.1 42.2,12.2 v42.2,11.1
  Bottom 0.305: U1.2 86,29.4 84.9,30.5 72.6,30.5 65.2,23.1 65.2,15.5 61.8,12.1 v60,12.1 | v42.2,11.1 42.2,9.7 43,8.9 52,8.9 v54.2,11.1
RF_MOSI  (via drill 0.6)
  Top 0.305: U8.25 37.72,10.18 v37.8,10.1
  Bottom 0.305: U1.3 88,29.3 86.2,31.1 72.3,31.1 64.6,23.4 64.6,15.9 61.9,13.2 59.6,13.2 53.5,7.1 39.7,7.1 37.8,9 v37.8,10.1
RF_SCK  (via drill 0.6)
  Top 0.305: U8.26 39,12.1 39.3,11.8 v39.3,10.4
  Bottom 0.305: U1.4 90,29 87.2,31.8 72,31.8 64,23.8 64,16.2 61.6,13.8 59.3,13.8 53.2,7.7 41,7.7 39.3,9.4 v39.3,10.4
RF_SS  (via drill 0.6)
  Top 0.305: U8.27 40,12.6 40.7,11.9 v40.7,10.7
  Bottom 0.305: U1.5 92,28.6 88.2,32.4 71.7,32.4 63.4,24.1 63.4,16.5 61.3,14.4 59,14.4 52.9,8.3 42.2,8.3 40.7,9.8 v40.7,10.7
RHT_BTN  (via drill 0.6)
  Top 0.305: R21.2 69.05,8.25 64.1,3.3 27.4,3.3 v26.2,4.5 | v25.9,12.9 26.1,13.1 U8.9
  Top 0.61: S5.A2 R21.2
  Bottom 0.305: v26.2,4.5 25.9,4.8 v25.9,12.9
RHT_MOUSE
  Top 0.254: S8.A2 46.58,7.9 37.8,7.9 37.4,8.3
  Top 0.305: 37.4,8.3 36.22,9.48 U8.24
  Top 0.406: S8.A2 48.67,9.95 R28.2
SWCLK  (via drill 0.6)
  Top 0.254: v30,22.8 30,22.4 32.22,20.18 U8.45 | JP22.4 34.61,28.81 v35.3,29.5
  Bottom 0.254: v35.3,29.5 33.4,27.6 33.4,25.3 32,23.9 30.7,23.9 30,23.2 v30,22.8
SWDIO  (via drill 0.6)
  Top 0.254: v29.2,21.4 30.1,21.4 31.72,19.78 U8.46 | JP22.2 34.94,27.54 v35.3,27.9
  Bottom 0.254: v35.3,27.9 36.3,28.9 36.3,30.1 35.7,30.7 34.7,30.7 32.6,28.6 32.6,25.5 31.7,24.6 30,24.6 28.7,23.3 28.7,21.9 v29.2,21.4
SYSOFF  (via drill 0.6)
  Top 0.254: U7.15 14.89,16.39 v15.7,17.2
  Top 0.305: S2.2 4.59,5.49 v5.3,6.2
  Bottom 0.305: v5.3,6.2 8.4,6.2 15.7,13.5 v15.7,17.2
TS
  Top 0.205: U6.10 29.64,30.64 28.38,29.38 R22.2
  Top 0.254: U7.1 13.46,18.26 16.3,21.1 16.3,23.3 22.38,29.38 R22.2
UP_BTN  (via drill 0.6)
  Top 0.305: R23.2 93.65,29.05 v91.9,30.8 | v43.3,11.8 41.5,13.6 U8.29
  Top 0.61: S6.A2 R23.2
  Bottom 0.305: v91.9,30.8 89.6,33.1 71.5,33.1 62.8,24.4 62.8,16.8 61.1,15.1 56.8,15.1 51.3,9.6 45.5,9.6 v43.3,11.8
USB_D+  (via drill 0.6)
  Top 0.305: v41.4,18.7 40.4,17.7 40.4,17 39.5,16.1 U8.34
  Top 0.406: JP23.D+1 7.1,22.9 9.4,25.2 11,25.2 v11.8,24.4
  Bottom 0.305: v11.8,24.4 12.1,24.7 16.1,24.7 22.6,18.2 30,18.2 30.7,18.9 41.2,18.9 v41.4,18.7
USB_D-  (via drill 0.6)
  Top 0.305: v41.7,17.3 40,15.6 U8.33
  Top 0.406: JP23.D-1 5.95,23.55 8.9,26.5 11.8,26.5 13.7,24.6 v13.7,23.5
  Bottom 0.305: v13.7,23.5 15.6,23.5 21.7,17.4 30.5,17.4 31.3,18.2 40,18.2 40.9,17.3 v41.7,17.3
USB_HOST_EN
  Top 0.305: R31.1 28.31,24.3 33.7,24.3 34.7,23.3 34.7,21 34.22,20.52 U8.41
V_BATT  (via drill 0.6)
  Top 0.205: U6.7 26.86,31.46 R11.1
  Top 0.254: 12.7,17.61 U7.3 | U7.2 12.7,17.61 | 12.7,17.61 12.7,18.1
  Top 0.305: R24.1 7.02,7.12 v7.3,7.4
  Top 0.61: 12.7,18.1 v12.7,19 12.7,20.01 C11.1 13.35,20.3 15.15,22.1 15.15,23.65 v23.2,31.7 24.81,31.7 R11.1
  Bottom 0.305: v7.3,7.4 12.7,12.8 v12.7,19
  Bottom 0.61: LASER.1 91.9,38.4 26.3,38.4 23.2,35.3 v23.2,31.7
V_USB  (via drill 0.6)
  Top 0.254: U7.13 14.58,15.39 C10.1
  Top 0.406: JP23.VBUS1 5.4,24.2 6.3,25.1 v6.3,25.9
  Top 0.61: C10.1 16.29,11.89 v16.2,11.8
  Bottom 0.406: v6.3,25.9 6.3,23.6 9.6,20.3 14.6,20.3 17.2,17.7 17.2,12.8 v16.2,11.8
  Bottom 0.61: SUPP.1 11.8,7.4 v16.2,11.8
VDDANA
  Top 0.305: U8.6 28.1,14.6 27.4,13.9 25.5,13.9 25.1,14.3 24.58,14.3 C14.1
VDDCORE
  Top 0.305: U8.43 33.22,21.31 C13.1
WHT_PWM  (via drill 0.6)
  Top 0.305: v68.7,20.3 68.7,23.1 69.1,23.5 R1.1 | v65.9,13.6 63.4,11.1 58.5,11.1 54.2,6.8 37.8,6.8 35.72,8.88 U8.23
  Bottom 0.305: v68.7,20.3 68.7,16.4 v65.9,13.6

### Text on the board
tPlace: + | - | CHRG
bPlace: AIZER | Laser Module | Designed By: Matt Sauvé